# EAGLE design kraft (EAGLE 7.3.0)
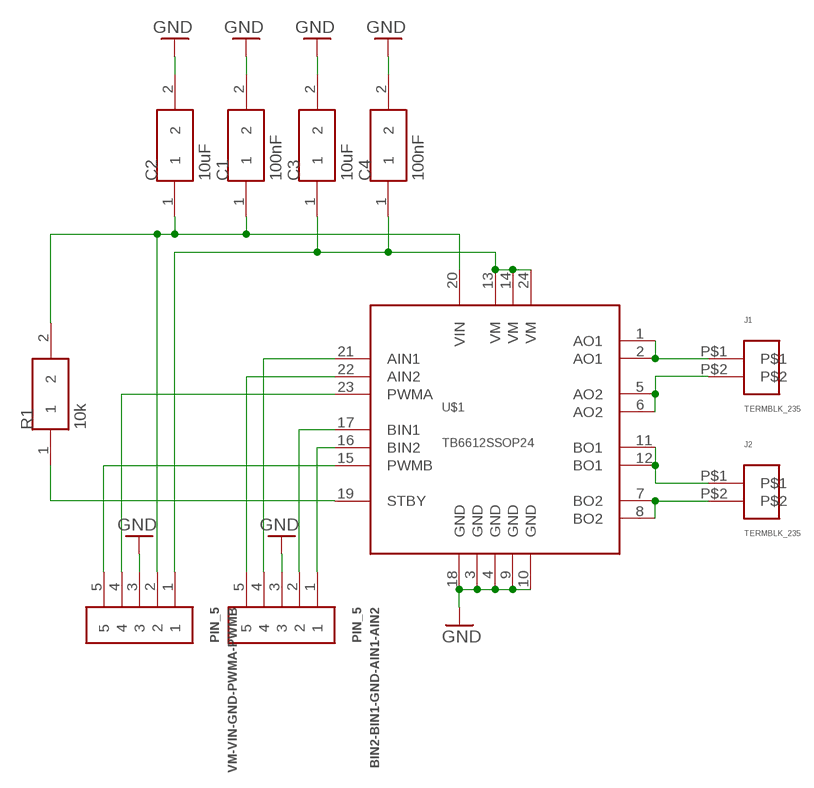
[diagram p0: schematic, sheet 1]

## Parts
BIN2-BIN1-GND-AIN1-AIN2  PIN_5  [PIN_5]
C1  100nF  CAP0805  [0805]
C2  10uF  CAP0805  [0805]
C3  10uF  CAP0805  [0805]
C4  100nF  CAP0805  [0805]
J1  TERMBLK_235  [TERMBLK_35_2]
J2  TERMBLK_235  [TERMBLK_35_2]
R1  10k  RES0805  [0805]
U$1  TB6612SSOP24  [SSOP24]
VM-VIN-GND-PWMA-PWMB  PIN_5  [PIN_5]

## Nets
GND: BIN2-BIN1-GND-AIN1-AIN2.3 C1.2 C2.2 C3.2 C4.2 U$1.3(GND) U$1.4(GND) U$1.9(GND) U$1.10(GND) U$1.18(GND) VM-VIN-GND-PWMA-PWMB.3
N$1: C1.1 C2.1 R1.2 U$1.20(VIN) VM-VIN-GND-PWMA-PWMB.2
N$2: C3.1 C4.1 U$1.13(VM) U$1.14(VM) U$1.24(VM) VM-VIN-GND-PWMA-PWMB.1
N$3: U$1.23(PWMA) VM-VIN-GND-PWMA-PWMB.4
N$4: U$1.15(PWMB) VM-VIN-GND-PWMA-PWMB.5
N$5: BIN2-BIN1-GND-AIN1-AIN2.4 U$1.21(AIN1)
N$6: BIN2-BIN1-GND-AIN1-AIN2.5 U$1.22(AIN2)
N$7: BIN2-BIN1-GND-AIN1-AIN2.2 U$1.17(BIN1)
N$8: BIN2-BIN1-GND-AIN1-AIN2.1 U$1.16(BIN2)
N$9: R1.1 U$1.19(STBY)
N$10: J1.P$1 U$1.1(AO1) U$1.2(AO1)
N$11: J1.P$2 U$1.5(AO2) U$1.6(AO2)
N$13: J2.P$1 U$1.11(BO1) U$1.12(BO1)
N$14: J2.P$2 U$1.7(BO2) U$1.8(BO2)

## Library data of the parts
BIN2-BIN1-GND-AIN1-AIN2 VM-VIN-GND-PWMA-PWMB = dooba:PIN_5
C1-C4 = dooba:CAP
J1 J2 = dooba:TERMBLK_2
R1 = dooba:RES
U$1 = dooba:TB6612

## Board
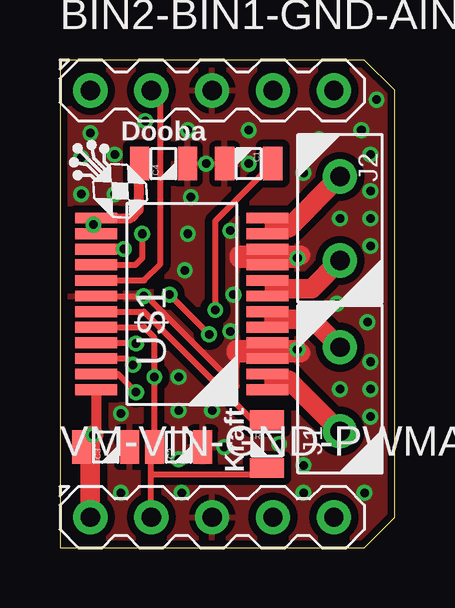
[diagram p1: board, top side]
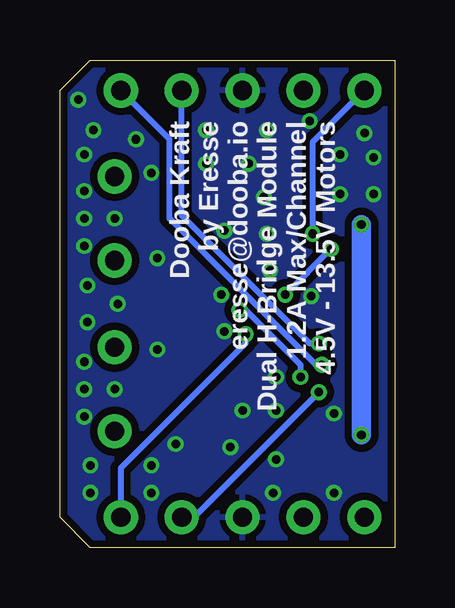
[diagram p2: board, bottom side, seen from below]

Size 13.97 x 20.32 mm. Coordinates in mm from the lower left corner, seen from the top.
Outline: 0,0 12.7,0 13.97,1.27 13.97,19.05 12.7,20.32 0,20.32 0,0
Copper layers (1*16): Top 0.035mm / dielectric 1.5mm / Bottom 0.035mm
Design rules "dooba": minimum track width 6mil, minimum drill 12mil, track to track 6mil, track to pad 6mil, pad to pad 6mil, via to via 6mil, smd to smd 0mil, copper to edge 10mil, drill to drill 10mil, minimum pad ring 10mil, minimum via ring 6mil, stop-mask expansion 2mil, vias tented up to drill 25mil, thermal gap 10mil

### Footprints (pad centres in the part's own frame; a part is rotated, then mirrored left to right if it is on the bottom)
PIN_5 = drill 0.8 pad 1.422: 1 -5.08,0; 2 -2.54,0; 3 0,0; 4 2.54,0; 5 5.08,0
0805 = smd 0.8 x 1.4: 1 -1,0; 2 1,0
TERMBLK_35_2 = drill 0.8 pad 1.422: P$1 -1.75,0; P$2 1.75,0
SSOP24 = smd 0.45 x 1.75: 1 -3.575,-3.575; 2 -2.925,-3.575; 3 -2.275,-3.575; 4 -1.625,-3.575; 5 -0.975,-3.575; 6 -0.325,-3.575; 7 0.325,-3.575; 8 0.975,-3.575; 9 1.625,-3.575; 10 2.275,-3.575; 11 2.925,-3.575; 12 3.575,-3.575; 13 3.575,3.575; 14 2.925,3.575; 15 2.275,3.575; 16 1.625,3.575; 17 0.975,3.575; 18 0.325,3.575; 19 -0.325,3.575; 20 -0.975,3.575; 21 -1.625,3.575; 22 -2.275,3.575; 23 -2.925,3.575; 24 -3.575,3.575

### Placement (x,y rotation side)
BIN2-BIN1-GND-AIN1-AIN2  6.35,19.05 0 top
C1  7.87,16 180 top
C2  4.95,4.19 0 top
C3  1.9,4.19 0 top
C4  4.32,16 0 top
J1  11.68,6.6 90 top
J2  11.68,13.72 270 top
R1  8.64,4.32 270 top
U$1  5.08,10.16 90 top
VM-VIN-GND-PWMA-PWMB  6.35,1.27 0 top

### Tracks (layer width: path | path; a pad name or v marks a point on that pad's centre or on a via)
GND  (via drill 0.36)
  Top 0.254: U$1.10 8.89,12.2 8.89,12.06 | U$1.4 8.89,8.3 8.89,8.26 | U$1.18 3.61,10.48 | 3.61,10.48 v3.49,10.48 | 3.61,10.48 7.37,6.73 7.37,7.75 7.24,7.87
  Top 0.813: 9.65,12.19 9.78,12.06 8.89,12.06 8.26,12.06 | 9.65,12.19 9.27,12.19 | 9.65,12.19 10.03,12.19 | 8.89,8.26 9.02,8.13 9.4,8.13 | 9.4,8.13 9.27,8.26 v9.91,8.26 10.03,8.13 9.4,8.13 | 8.26,12.06 7.49,12.06 7.49,12.19 8.38,12.19 8.26,12.06 | 8.89,8.26 7.37,8.26 7.37,8.13 8.76,8.13 8.89,8.26
  Bottom 0.254: v3.49,10.48 3.56,10.41
  other vias: 2.54,2.29 5.08,2.29 10.16,2.29 12.7,2.29 4.95,3.68 6.86,4.19 9.14,4.32 2.54,5.59 10.16,3.43 12.7,3.43 4.95,7.11 4.95,5.71 6.35,5.71 5.21,11.56 5.33,13.08 5.46,14.6 6.1,16 7.87,16 2.29,14.73 0.89,14.73 1.27,17.27 2.29,16.38 0.89,16.26 3.56,17.78 5.33,17.4 7.87,17.4 7.11,13.21 7.11,9.02 10.8,17.02 13.21,18.67 12.57,17.4 11.68,13.72 11.68,6.6 11.56,10.16 9.91,12.06 10.16,15.62 12.95,13.72 12.95,14.86 12.95,12.57 12.95,6.6 12.95,7.75 12.95,5.46 12.95,16.38 12.83,9.4 12.83,10.92 7.24,10.54
  pour Top (isolate 0.305): 0,20.32 12.7,20.32 13.97,19.05 13.97,1.27 12.7,0 0,0
  pour Bottom (isolate 0.305): 0,20.32 12.7,20.32 13.97,19.05 13.97,1.27 12.7,0 0,0
N$1  (via drill 0.36)
  Top 0.254: VM-VIN-GND-PWMA-PWMB.2 3.81,3.05 | 3.81,3.05 3.81,4.05 C2.1 3.94,4.21 v3.94,7.11 3.94,8.76 3.52,9.19 U$1.20 | C1.1 6.48,13.6 v6.48,9.91 | R1.2 8.37,3.05 3.81,3.05
  Bottom 0.254: v6.48,9.91 6.22,9.91 3.94,7.62 v3.94,7.11
N$2  (via drill 0.36)
  Top 0.406: C4.1 3.3,15.99 3.3,14.1 2.94,13.73 U$1.13 U$1.14 1.5,13.35 v1.4,13.46 | U$1.24 1.5,4.59 | C3.1 1.38,4.61 1.5,4.59 | 1.5,4.59 v1.4,4.7
  Top 0.813: v1.4,4.7 1.27,4.57 VM-VIN-GND-PWMA-PWMB.1
  Bottom 0.813: v1.4,13.46 v1.4,4.7
N$3  (via drill 0.36)
  Top 0.254: U$1.23 2.42,7.23 v3.17,6.48
  Bottom 0.254: v3.17,6.48 8.38,1.27 VM-VIN-GND-PWMA-PWMB.4
N$4  (via drill 0.36)
  Top 0.254: U$1.15 2.66,12.44 v2.67,12.45 | v4.57,10.54 v6.22,8.89
  Bottom 0.254: v2.67,12.45 v4.57,10.54 | v6.22,8.89 6.22,8.51 11.43,3.3 VM-VIN-GND-PWMA-PWMB.5
N$5  (via drill 0.36)
  Top 0.254: U$1.21 3.15,8.53 v3.17,8.51
  Bottom 0.254: v3.17,8.51 3.56,8.51 8.89,13.84 BIN2-BIN1-GND-AIN1-AIN2.4
N$6  (via drill 0.36)
  Top 0.254: U$1.22 2.78,7.88 v3.05,7.62
  Bottom 0.254: v3.05,7.62 3.3,7.62 9.4,13.72 9.4,17.02 BIN2-BIN1-GND-AIN1-AIN2.5
N$7
  Top 0.254: U$1.17 3.52,11.13 4.19,11.81 4.19,18.67 BIN2-BIN1-GND-AIN1-AIN2.2
N$8  (via drill 0.36)
  Top 0.254: v3.43,13.08 3.43,12.06 3.15,11.78 U$1.16
  Bottom 0.254: BIN2-BIN1-GND-AIN1-AIN2.1 3.43,16.89 v3.43,13.08
N$9
  Top 0.254: U$1.19 3.5,9.84 8,5.33 8.62,5.33 R1.1
N$10
  Top 0.254: 9.02,6.98 8.91,6.98 U$1.2 U$1.1
  Top 0.813: J1.P$1 9.55,6.98 9.02,6.98
N$11
  Top 0.254: U$1.5 U$1.6 8.71,9.84 9.02,9.52
  Top 0.813: J1.P$2 10.51,9.52 9.02,9.52
N$13
  Top 0.254: U$1.12 U$1.11 8.91,13.34 9.02,13.34
  Top 0.813: J2.P$1 9.55,13.34 9.02,13.34
N$14
  Top 0.254: U$1.8 U$1.7 8.96,10.8 9.02,10.8
  Top 0.813: J2.P$2 10.51,10.8 9.02,10.8

### Text on the board
tPlace: Dooba | Kraft
bPlace: Dooba Kraft / by Eresse / eresse@dooba.io / Dual H-Bridge Module / 1.2A Max/Channel / 4.5V - 13.5V Motors